# Altium schematic sheet Buck_Schematic.schdoc
size A4; Organization: Waterloop; Address1: 200 University Ave W; Address2: Engineering 5, 1104; Address3: Waterloo, ON; Address4: N2L 3G1; DocumentNumber: 2; SheetNumber: 2; SheetTotal: 5
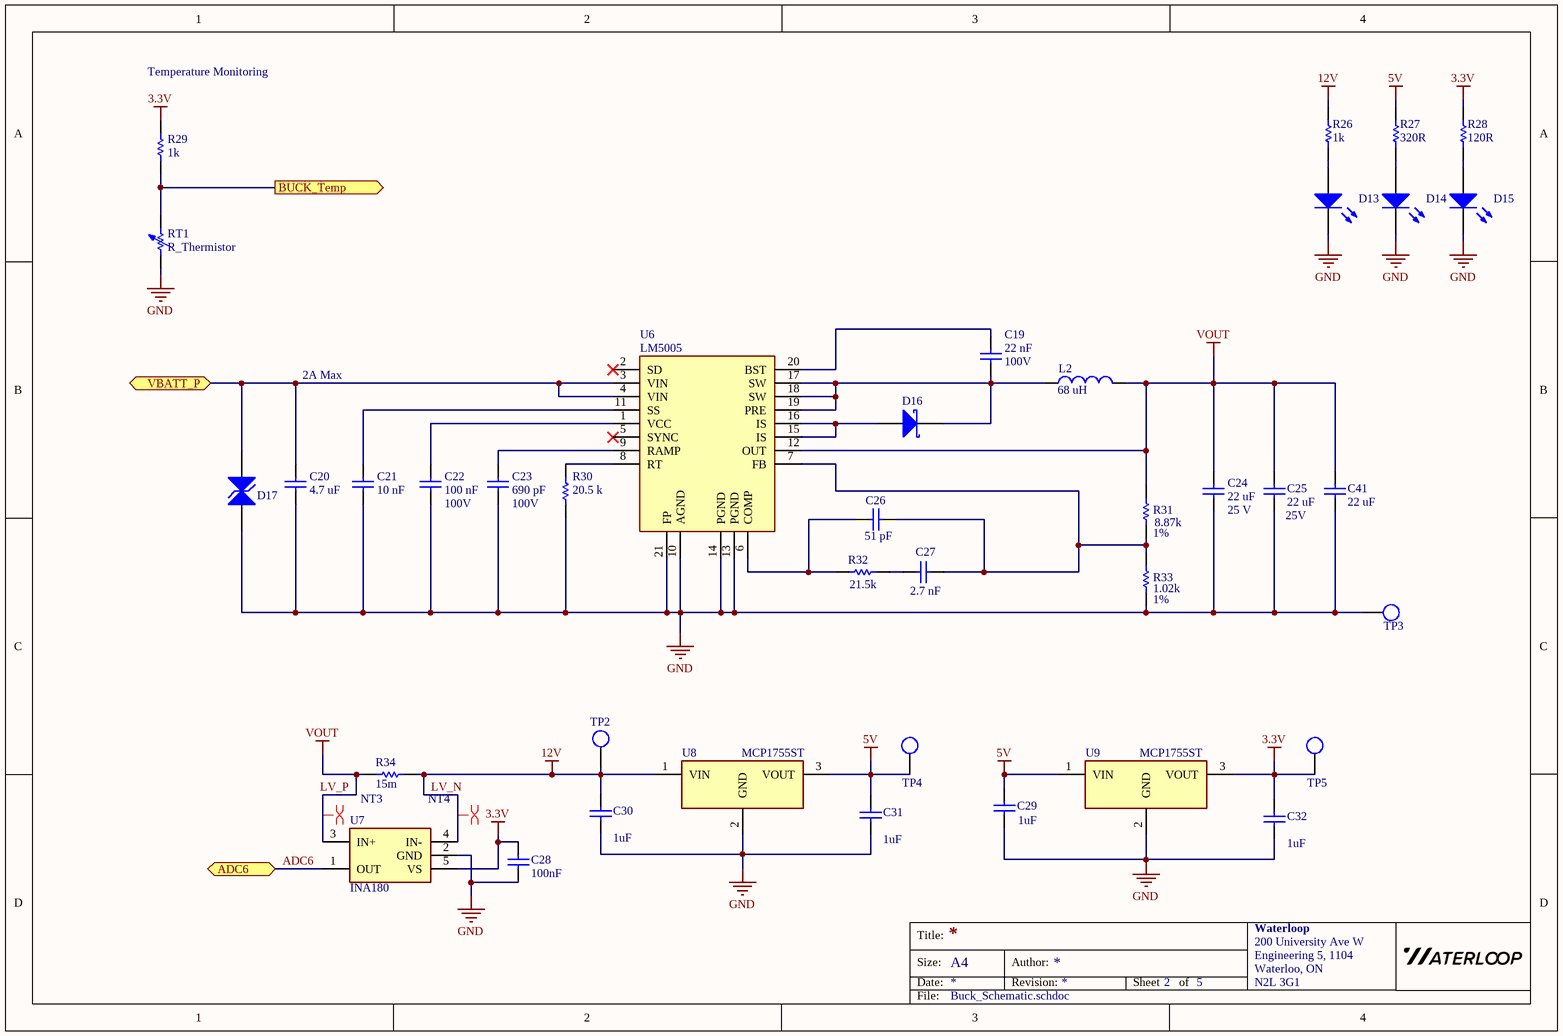
[diagram p0: Buck_Schematic.schdoc]

## Parts
C19  value 22 nF  [0805 - Capacitor]
C20  value 4.7 uF  [1210 - Capacitor]
C21  value 10 nF  [0805 - Capacitor]
C22  value 100 nF  [0805 - Capacitor]
C23  value 690 pF  [0805 - Capacitor]
C24  value 22 uF  [1210 - Capacitor]
C25  value 22 uF  [1210 - Capacitor]  (hidden comment: Capacitor - Nonpolarized)
C26  value 51 pF  [0805 - Capacitor]
C27  value 2.7 nF  [0805 - Capacitor]
C28  value 100nF  [0805 - Capacitor]  (hidden comment: Capacitor - Nonpolarized)
C29  value 1uF  [0805 - Capacitor]  (hidden comment: 1 uF)
C30  1uF  [0805 - Capacitor]
C31  1uF  [0805 - Capacitor]
C32  value 1uF  [0805 - Capacitor]  (hidden comment: 1 uF)
C41  value 22 uF  [1210 - Capacitor]  (hidden comment: Capacitor - Nonpolarized)
D13  LED  [0805 - Resistor]  (value not drawn)
D14  LED  [0805 - Resistor]  (value not drawn)
D15  LED  [0805 - Resistor]  (value not drawn)
D16  Diode - Schottky  [SMA - DIODE]  (value not drawn)
D17  TVS  [SMB - DIODE]  (value not drawn)
L2  value 68 uH  [MSS1210 - INDUCTOR]  (hidden comment: Inductor)
NT3  NetTie  [Net Tie]  (value not drawn)  (net tie, no BOM)
NT4  NetTie  [Net Tie]  (value not drawn)  (net tie, no BOM)
R26  value 1k  [0603 - Resistor]  (hidden comment: Resistor)
R27  value 320R  [0603 - Resistor]  (hidden comment: Resistor)
R28  value 120R  [0603 - Resistor]  (hidden comment: Resistor)
R29  value 1k  [0603 - Resistor]  (hidden comment: Resistor)
R30  value 20.5 k  [0603 - Resistor]
R31  value 8.87k  [0805 - Resistor]
R32  value 21.5k  [0603 - Resistor]
R33  value 1.02k  [0805 - Resistor]
R34  value 15m  [0805 - Resistor]  (hidden comment: Resistor)
RT1  value R_Thermistor  [0603 - Resistor]  (hidden comment: Resistor - Variable)
TP2  (no value)  [Test Point - 5002]  (no BOM)
TP3  (no value)  [Test Point - 5002]  (no BOM)
TP4  (no value)  [Test Point - 5002]  (no BOM)
TP5  (no value)  [Test Point - 5002]  (no BOM)
U6  LM5005  [LM5005]
U7  INA180  [INA180]
U8  MCP1755ST  [MCP1755ST]
U9  MCP1755ST  [MCP1755ST]

## Ports
ADC6 (bidir), BUCK_Temp (out), VBATT_P (bidir)

## Nets
3.3V: C28.2 C32.1 R28.1 R29.2 TP5.1 U7.5(VS) U9.3(VOUT)
5V: C29.1 C31.1 R27.1 TP4.1 U8.3(VOUT) U9.1(VIN)
12V: C30.1 NT4.1 R26.1 R34.1 TP2.1 U8.1(VIN)
GND: C20.1 C21.1 C22.1 C23.1 C24.2 C25.1 C28.1 C29.2 C30.2 C31.2 C32.2 C41.1 D13.2(K) D14.2(K) D15.2(K) D17.1(A) R30.1 R33.1 RT1.1 TP3.1 U6.10(AGND) U6.13(PGND) U6.14(PGND) U6.21(FP) U7.2(GND) U8.2(GND) U9.2(GND)
VOUT: C24.1 C25.2 C41.2 L2.2 NT3.1 R31.2 R34.2 U6.12(OUT)
ADC6: U7.1(OUT) ; port ADC6
BUCK_Temp: R29.1 RT1.2 ; port BUCK_Temp
LV_N: NT4.2 U7.4(IN-)
LV_P: NT3.2 U7.3(IN+)
VBATT_P: C20.2 D17.2(K) U6.3(VIN) U6.4(VIN) ; port VBATT_P
NetC19_1: C19.1 D16.2(K) L2.1 U6.17(SW) U6.18(SW) U6.19(PRE)
NetC19_2: C19.2 U6.20(BST)
NetC21_2: C21.2 U6.11(SS)
NetC22_2: C22.2 U6.1(VCC)
NetC23_2: C23.2 U6.9(RAMP)
NetC26_1: C26.1 C27.1 R31.1 R33.2 U6.7(FB)
NetC26_2: C26.2 R32.2 U6.6(COMP)
NetC27_2: C27.2 R32.1
NetD13_1: D13.1(A) R26.2
NetD14_1: D14.1(A) R27.2
NetD15_1: D15.1(A) R28.2
NetD16_1: D16.1(A) U6.15(IS) U6.16(IS)
NetR30_2: R30.2 U6.8(RT)

Not connected (* = marked no-connect by the designer): U6 2(SD)* 5(SYNC)*

## Layout directives
differential pair: LV_N, LV_P

## Notes on the sheet
- Temperature Monitoring
- 2A Max
- (near C19) 100V
- (near C22) 100V
- (near C23) 100V
- 25 V
- (near C25) 25V
- (near R31) 1%
- (near R33) 1%
- Title:
- Size:
- Date:
- A4
- Author:
- Revision:
- Sheet
- of
- File:

## Library data of the parts
C19 = Capacitor - Nonpolarized: CC0805MRX7R0BB223, 0.022 µF± 20% 100V Ceramic Capacitor X7R 0805 (2012 Metric); Manufacturer: YAGEO; Supplier Part Number: 311-1905-1-ND; Supplier: Digi-Key; Rating: *; Manufacturer Part Number: CC0805MRX7R0BB223
C20 = Capacitor - Nonpolarized: C3225X7S2A475M200AB, CAP CER 4.7UF 100V X7S 1210; Manufacturer: TDK Corporation; Supplier Part Number: 445-6043-1-ND; Supplier: Digi-Key; Rating: *; Manufacturer Part Number: C3225X7S2A475M200AB
C21 = Capacitor - Nonpolarized: CC0805KRX7R0BB103, 10000 pF ±10% 100V Ceramic Capacitor X7R 0805 (2012 Metric); Manufacturer: YAGEO; Supplier Part Number: 311-1475-1-ND; Supplier: Digi-Key; Rating: *; Manufacturer Part Number: CC0805KRX7R0BB103
C22 = Capacitor - Nonpolarized: CC0805KKX7R0BB104, 0.1uF ± 10% 100V Ceramic Capacitor X7R 0805 (2012 Metric); Manufacturer: YAGEO; Supplier Part Number: 311-2083-1-ND; Supplier: Digi-Key; Rating: *; Manufacturer Part Number: CC0805KKX7R0BB104
C23 = Capacitor - Nonpolarized: CC0805KRX7R0BB681, 680 pF ± 10% 100V Ceramic Capacitor X7R 0805 (2012 Metric); Manufacturer: YAGEO; Supplier Part Number: 311-4308-1-ND; Supplier: Digi-Key; Rating: *; Manufacturer Part Number: CC0805KRX7R0BB681
C24 = Capacitor - Nonpolarized: CC0805ZKY5V6BB226, CAP CER 22UF 10V Y5V 0805; Manufacturer: KYOCERA AVX; Manufacturer Part Number: 12103D226MAT2A; Rating: 25V; Supplier: Digi-Key; Supplier Part Number: 478-5045-1-ND
C25 C41 = Capacitor - Nonpolarized: EEE-FK1A220R, CAP ALUM 22UF 20% 10V SMD; Manufacturer: KYOCERA AVX; Manufacturer Part Number: 12103D226MAT2A; Rating: 25V; Supplier Part Number: 478-5045-1-ND; Supplier: Digi-Key
C26 = Capacitor - Nonpolarized: CL21C510JBANNNC,  51 pF ± 5% 50V Ceramic Capacitor C0G NP0 0805 (2012 Metric); Manufacturer: Samsung Electro-Mechanics; Supplier Part Number: 1276-2670-1-ND; Supplier: Digi-Key; Rating: *; Manufacturer Part Number: CL21C510JBANNNC
C27 = Capacitor - Nonpolarized: CC0805KRX7R9BB272, 2700 pF ±10% 50V Ceramic Capacitor X7R 0805 (2012 Metric); Manufacturer: YAGEO; Supplier Part Number: 311-1130-1-ND; Supplier: Digi-Key; Rating: *; Manufacturer Part Number: CC0805KRX7R9BB272
C28 = Capacitor - Nonpolarized: CC0805KRX7R9BB104, 0.1 µF / ±10% 50V Ceramic Capacitor X7R 0805 (2012 Metric); Manufacturer: YAGEO; Supplier Part Number: 311-1140-1-ND; Supplier: Digi-Key; Rating: 50V; Manufacturer Part Number: CC0805KRX7R9BB104
C29-C32 = Capacitor - Nonpolarized: Nonpolarized Capacitor; Manufacturer: YAGEO; Manufacturer Part Number: CC0805KKX5R8BB105; Rating: 25V; Supplier Part Number: 311-1868-1-ND; Supplier: Digikey
  C30 C31: Value: 1uF
D13-D15 = LED: 150080SS75000, LED RED CLEAR 0805 SMD; Manufacturer: Würth Elektronik; Value: *; Manufacturer Part Number: 150080SS75000; Supplier Part Number: 732-4985-1-ND; Rating: *; Supplier: Digi-Key
D16 = Diode - Schottky: SK220ATR, 200V 2A SMA; Manufacturer: SMC Diode Solutions; Rating: *; Supplier Part Number: 1655-2135-1-ND; Supplier: Digi-Key; ComponentLink1Description: Manufacturer Link; ComponentLink1URL: http://www.irf.com/; ComponentLink2Description: Datasheet; ComponentLink2URL: http://www.irf.com/product-info/datasheets/data/10tq.pdf; Value: *; Manufacturer Part Number: SK220ATR
D17 = TVS: TVS Diode; Manufacturer Part Number: 824521601; Manufacturer: Wurth; Supplier: Digikey; Supplier Part Number: 732-9756-1-ND; Value: *
L2 = Inductor: MSS1210-683MEB, 68 uH ± 20% 4.3 A Ferrite; Manufacturer: Coilcraft; Rating: *; Manufacturer Part Number: MSS1210-683MEB; Supplier Part Number: 994-MSS1210-683MEB; Supplier: Mouser
NT3 NT4 = Net Tie
R26 = Resistor: RC0603FR-07510RL, RES 510 OHM 1% 1/10W 0603; Manufacturer Part Number: RC0603JR-071KL; Manufacturer: YAGEO; Rating: 0.1W; Supplier Part Number: 311-1.0KGRCT-ND; Supplier: Digi-Key
R27 = Resistor: RC0603FR-07510RL, RES 510 OHM 1% 1/10W 0603; Manufacturer Part Number: RC0603FR-07330RL; Manufacturer: YAGEO; Rating: 0.1W; Supplier Part Number: 311-330HRCT-ND; Supplier: Digi-Key
R28 = Resistor: RC0603FR-07510RL, RES 510 OHM 1% 1/10W 0603; Manufacturer Part Number: RC0603FR-10120RL; Manufacturer: YAGEO; Rating: 0.1W; Supplier Part Number: 13-RC0603FR-10120RLCT-ND; Supplier: Digi-Key
R29 = Resistor: RC0603FR-071KL, 1 kOhms ±1% 0.1W Thick Film 0603 (1608 Metric); Manufacturer Part Number: RC0603JR-071KL; Manufacturer: YAGEO; Rating: 0.1W; Supplier Part Number: 311-1.0KGRCT-ND; Supplier: Digi-Key
R30 = Resistor: CRCW060320K5FKEA, 20.5 kOhms ± 1%, 0.1W Thick Film 0603 (1608 Metric); Manufacturer: Vishay Dale; Rating: *; Manufacturer Part Number: CRCW060320K5FKEA; Supplier Part Number: 541-20.5KHCT-ND; Supplier: Digi-Key
R31 = Resistor: ERJ-6ENF8871V, 8.87 kOhms ±1% 0.125W Thick Film 0805 (2012 Metric); Manufacturer: Panasonic Electronic Components; Rating: *; Manufacturer Part Number: ERJ-6ENF8871V; Supplier Part Number: P8.87KCCT-ND; Supplier: Digi-Key
R32 = Resistor: CRCW060321K5FKEA, 21.5 kOhms / ±1% 0.1W Thick Film 0603 (1608 Metric); Manufacturer: Vishay Dale; Rating: *; Manufacturer Part Number: CRCW060321K5FKEA; Supplier Part Number: 541-21.5KHCT-ND; Supplier: Digi-Key
R33 = Resistor: ERJ-6ENF1021V, 1.02 kOhms ±1% 0.125W Thick Film 0805 (2012 Metric); Manufacturer: Panasonic Electronic Components; Rating: *; Manufacturer Part Number: ERJ-6ENF1021V; Supplier Part Number: P1.02KCCT-ND; Supplier: Digi-Key
R34 = Resistor: Manufacturer Part Number: ERJ-6CWDR015V; Manufacturer: Panasonic; Rating: 0.5W; Supplier Part Number: P124405CT-ND; Supplier: Digikey
RT1 = Resistor - Variable: ERT-J1VR103J, THERMISTOR NTC 10KOHM 4250K 0603; Manufacturer: Panasonic Electronic Components; Rating: *; Manufacturer Part Number: ERT-J1VR103J; Supplier Part Number: P10547CT-ND; Supplier: Digi-Key
TP2-TP5 = Test Point
U6 = LM5005: 7V to 75V 2.5A, Buck Converter; Manufacturer: Texas Instruments; Manufacturer Part Number: LM5005MHX/NOPB; Supplier Part Number: 926-LM5005MHX/NOPB; Supplier: Mouser; ComponentLink1Description: Datasheet; ComponentLink1URL: https://www.ti.com/lit/ds/symlink/lm5005.pdf?HQS=TI-null-null-digikeymode-df-pf-null-wwe&ts=1606456124909
U7 = INA180: 0V to 26V Current Sense Amplifier; Manufacturer: Texas Instruments; Manufacturer Part Number: INA180A3QDBVRQ1; Supplier Part Number: 296-INA180A3QDBVRQ1CT-ND; Supplier: Digikey; ComponentLink1Description: Datasheet; ComponentLink1URL: https://www.ti.com/lit/ds/symlink/ina180.pdf?ts=1618562671692&ref_url=https%253A%252F%252Fwww.google.com%252F
U8 U9 = MCP1755ST: Linear Regulator 300mA; Manufacturer: Microchip; Supplier: Digikey; Supplier Part Number: *; Manufacturer Part Number: *; ComponentLink1Description: Datasheet; ComponentLink1URL: http://ww1.microchip.com/downloads/en/devicedoc/25160a.pdf